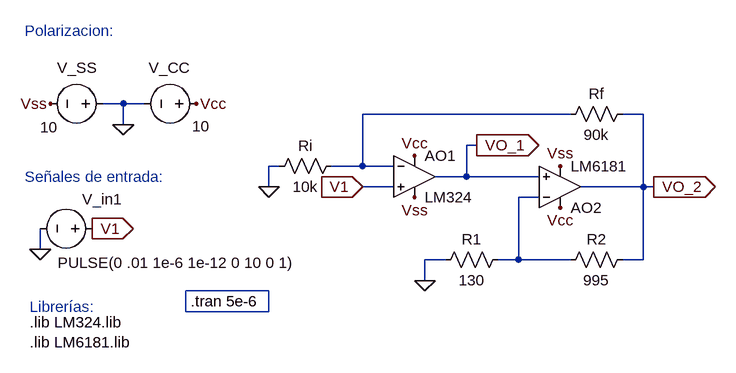
[diagram p0: schematic Lab_3_Circ_2-Respuesta al escalon 2.asc]
Lab_3_Circ_2-Respuesta al escalon 2.asc, the LTspice schematic file:
Version 4
SHEET 1 1704 680
WIRE 32 -256 0 -256
WIRE 64 -256 32 -256
WIRE 720 -240 400 -240
WIRE 832 -240 800 -240
WIRE 32 -224 32 -256
WIRE 576 -192 560 -192
WIRE 272 -160 256 -160
WIRE 400 -160 400 -240
WIRE 400 -160 352 -160
WIRE 448 -160 400 -160
WIRE 560 -144 560 -192
WIRE 560 -144 512 -144
WIRE 672 -144 560 -144
WIRE 256 -128 256 -160
WIRE 448 -128 400 -128
WIRE 832 -128 832 -240
WIRE 832 -128 736 -128
WIRE 848 -128 832 -128
WIRE 672 -112 640 -112
WIRE -96 -32 -96 -64
WIRE 528 -16 496 -16
WIRE 640 -16 640 -112
WIRE 640 -16 608 -16
WIRE 720 -16 640 -16
WIRE 832 -16 832 -128
WIRE 832 -16 800 -16
WIRE 496 16 496 -16
FLAG 496 16 0
FLAG 144 -256 Vcc
FLAG 480 -176 Vcc
FLAG -80 -256 Vss
FLAG 480 -112 Vss
FLAG 32 -224 0
FLAG 400 -128 V1
IOPIN 400 -128 In
FLAG 848 -128 VO_2
IOPIN 848 -128 Out
FLAG 704 -96 Vcc
FLAG 704 -160 Vss
FLAG 256 -128 0
FLAG 576 -192 VO_1
IOPIN 576 -192 Out
FLAG -96 -32 0
FLAG -16 -64 V1
IOPIN -16 -64 Out
SYMBOL OpAmps\\opamp2 480 -208 R0
SYMATTR InstName AO1
SYMATTR Value LM324
SYMBOL res 624 -32 R90
WINDOW 0 0 56 VBottom 2
WINDOW 3 32 56 VTop 2
SYMATTR InstName R1
SYMATTR Value 130
SYMBOL res 704 0 R270
WINDOW 0 32 56 VTop 2
WINDOW 3 0 56 VBottom 2
SYMATTR InstName R2
SYMATTR Value 995
SYMBOL res 816 -256 R90
WINDOW 0 0 56 VBottom 2
WINDOW 3 32 56 VTop 2
SYMATTR InstName Rf
SYMATTR Value 90k
SYMBOL res 256 -144 R270
WINDOW 0 32 56 VTop 2
WINDOW 3 0 56 VBottom 2
SYMATTR InstName Ri
SYMATTR Value 10k
SYMBOL voltage 160 -256 R90
WINDOW 0 -55 25 VRight 2
WINDOW 3 35 -5 VRight 2
WINDOW 123 0 0 Left 0
WINDOW 39 0 0 Left 0
SYMATTR InstName V_CC
SYMATTR Value 10
SYMBOL voltage 16 -256 R90
WINDOW 0 -55 25 VRight 2
WINDOW 3 36 85 VRight 2
WINDOW 123 0 0 Left 0
WINDOW 39 0 0 Left 0
SYMATTR InstName V_SS
SYMATTR Value 10
SYMBOL OpAmps\\opamp2 704 -64 M180
SYMATTR InstName AO2
SYMATTR Value LM6181
SYMBOL voltage 0 -64 M270
WINDOW 0 45 31 VLeft 2
WINDOW 3 -53 69 VLeft 2
WINDOW 123 -1 -56 VLeft 2
WINDOW 39 0 0 Left 0
SYMATTR InstName V_in1
SYMATTR Value PULSE(0 .01 1e-6 1e-12 0 10 0 1)
TEXT -112 80 Left 2 !.lib LM324.lib\n.lib LM6181.lib
TEXT -112 56 Left 2 ;Librerías:
TEXT -120 -368 Left 2 ;Polarizacion:
TEXT -120 -144 Left 2 ;Señales de entrada:
TEXT 136 48 Left 2 !.tran 5e-6
RECTANGLE Normal 256 64 128 32

The netlist it stands for:
* Lab_3_Circ_2-Respuesta al escalon 2.asc
XAO1 V1 N001 Vcc Vss VO_1 LM324  ; pins In+ In- V+ V- OUT
R1 N002 0 130
R2 N002 VO_2 995
Rf VO_2 N001 90k
Ri 0 N001 10k
V_CC Vcc 0 10
V_SS 0 Vss 10
XAO2 VO_1 N002 Vcc Vss VO_2 LM6181  ; pins In+ In- V+ V- OUT
V_in1 V1 0 PULSE(0 .01 1e-6 1e-12 0 10 0 1)
.lib LM324.lib
.lib LM6181.lib
* Librerías:
* Polarizacion:
* Señales de entrada:
.tran 5e-6
.backanno
.end